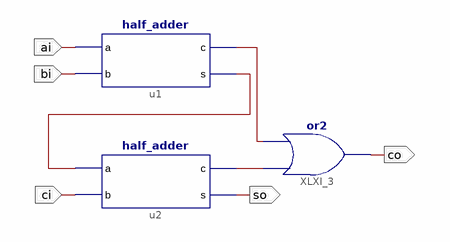
[diagram p0: schematic sheet 1]
// Xilinx ISE schematic full_adder.sch (spartan6) as structural Verilog: 3 symbols, 5 ports
module full_adder (
  input  ai,
  input  bi,
  input  ci,
  output co,
  output so
);

  wire XLXN_2, XLXN_5, XLXN_7;

  half_adder u1 (.a(ai), .b(bi), .c(XLXN_5), .s(XLXN_2));
  half_adder u2 (.a(XLXN_2), .b(ci), .c(XLXN_7), .s(so));
  or XLXI_3 (co, XLXN_7, XLXN_5);
endmodule
